# Altium schematic sheet Master.SchDoc: F405 Dev Board
size A4; Author: Alfonso Faria Espinoza; Organization: Waterloop; Address1: 200 University Ave W; Address2: Engineering 5, 1104; Address3: Waterloo, ON; Address4: N2L 3G1; Revision: 1.0; SheetNumber: 1; SheetTotal: 2
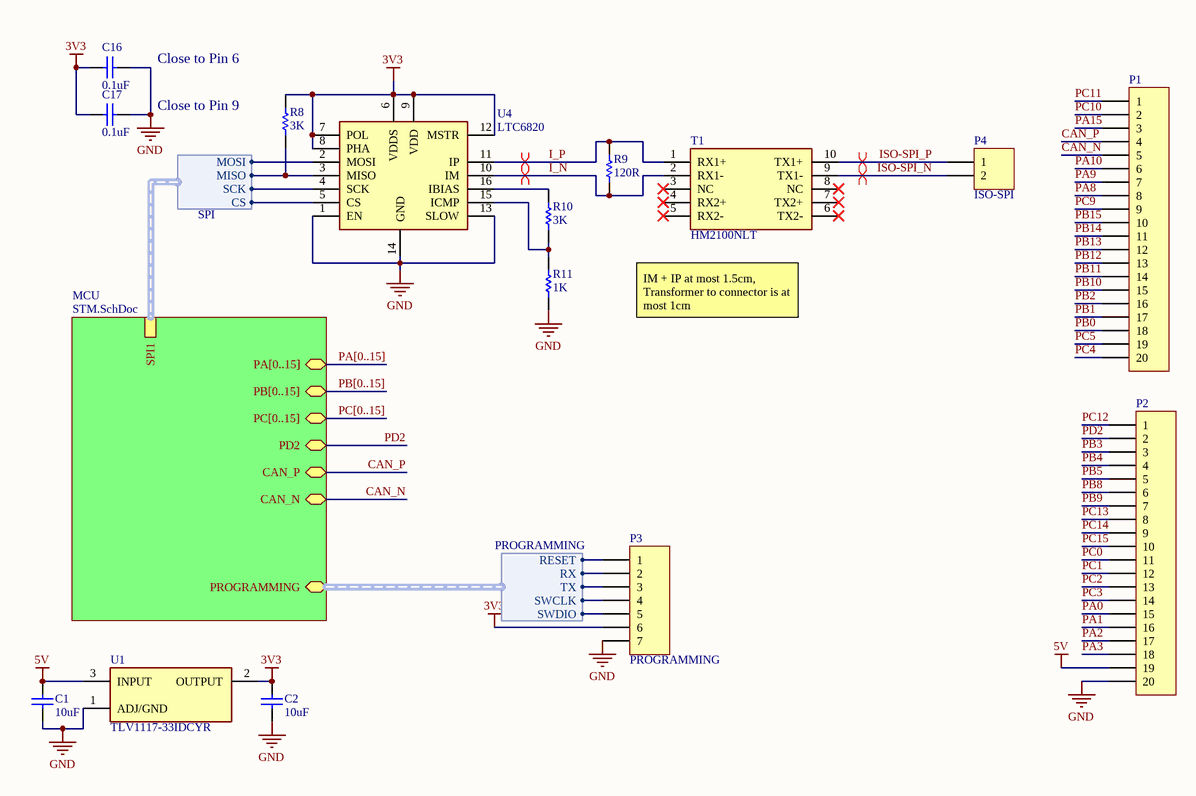
[diagram p0: Master.SchDoc]

## Parts
C1  value 10uF  [0805 - Capacitor]  (hidden comment: Capacitor - Nonpolarized)
C2  value 10uF  [0805 - Capacitor]  (hidden comment: Capacitor - Nonpolarized)
C16  value 0.1uF  [0805 - Capacitor]  (hidden comment: Capacitor - Nonpolarized)
C17  value 0.1uF  [0805 - Capacitor]  (hidden comment: Capacitor - Nonpolarized)
P1  1x20 Header  [HDR1X20]  (value not drawn)
P2  1x20 Header  [HDR1X20]  (value not drawn)
P3  PROGRAMMING  [HDR1X7]
P4  ISO-SPI  [HDR1X2]
R8  value 3K  [0603 - Resistor]  (hidden comment: Resistor)
R9  value 120R  [0603 - Resistor]  (hidden comment: Resistor)
R10  value 3K  [0603 - Resistor]  (hidden comment: Resistor)
R11  value 1K  [0603 - Resistor]  (hidden comment: Resistor)
T1  HM2100NLT  [HM2100NLT]
U1  TLV1117-33IDCYR  [TLV1117]
U4  LTC6820  [LTC6820]

## Sub-sheets
MCU = STM.SchDoc: PA[0..15] (bidir), PB[0..15] (bidir), PC[0..15] (bidir), PD2 (bidir), CAN_P (bidir), CAN_N (bidir), SPI1 (harness SPI), PROGRAMMING (bidir, harness PROGRAMMING)

## Harnesses
SPI: CS, MISO, MOSI, SCK
PROGRAMMING: RESET, RX, SWCLK, SWDIO, TX

## Nets
3V3: C2.2 C16.2 C17.2 P3.6 R8.2 U1.2(OUTPUT) U4.6(VDDS) U4.7(POL) U4.8(PHA) U4.9(VDD) U4.12(MSTR)
5V: C1.2 P2.19 U1.3(INPUT)
GND: C1.1 C2.1 C16.1 C17.1 P2.20 P3.7 R11.1 U1.1(ADJ/GND) U4.1(EN) U4.13(SLOW) U4.14(GND)
CAN_N: P1.5 ; sheet MCU/CAN_N
CAN_P: P1.4 ; sheet MCU/CAN_P
I_N: R9.1 T1.2(RX1-) U4.10(IM)
I_P: R9.2 T1.1(RX1+) U4.11(IP)
ISO-SPI_N: P4.2 T1.9(TX1-)
ISO-SPI_P: P4.1 T1.10(TX1+)
PA0: P2.15
PA1: P2.16
PA2: P2.17
PA3: P2.18
PA8: P1.8
PA9: P1.7
PA10: P1.6
PA15: P1.3
PB0: P1.18
PB1: P1.17
PB2: P1.16
PB3: P2.3
PB4: P2.4
PB5: P2.5
PB8: P2.6
PB9: P2.7
PB10: P1.15
PB11: P1.14
PB12: P1.13
PB13: P1.12
PB14: P1.11
PB15: P1.10
PC0: P2.11
PC1: P2.12
PC2: P2.13
PC3: P2.14
PC4: P1.20
PC5: P1.19
PC9: P1.9
PC10: P1.2
PC11: P1.1
PC12: P2.1
PC13: P2.8
PC14: P2.9
PC15: P2.10
PD2: P2.2 ; sheet MCU/PD2
NetP3_1: P3.1 ; sheet MCU/PROGRAMMING.RESET
NetP3_2: P3.2 ; sheet MCU/PROGRAMMING.RX
NetP3_3: P3.3 ; sheet MCU/PROGRAMMING.TX
NetP3_4: P3.4 ; sheet MCU/PROGRAMMING.SWCLK
NetP3_5: P3.5 ; sheet MCU/PROGRAMMING.SWDIO
NetR8_1: R8.1 U4.3(MISO) ; sheet MCU/SPI1.MISO
NetR10_1: R10.1 R11.2 U4.15(ICMP)
NetR10_2: R10.2 U4.16(IBIAS)
NetU4_2: U4.2(MOSI) ; sheet MCU/SPI1.MOSI
NetU4_4: U4.4(SCK) ; sheet MCU/SPI1.SCK
NetU4_5: U4.5(CS) ; sheet MCU/SPI1.CS

Not connected (* = marked no-connect by the designer): T1 3(NC)* 4(RX2+)* 5(RX2-)* 6(TX2-)* 7(TX2+)* 8(NC)*

## Buses and harness runs
bus PA[0..15] = sheet MCU/PA[0..15]
bus PB[0..15] = sheet MCU/PB[0..15]
bus PC[0..15] = sheet MCU/PC[0..15]

## Layout directives
differential pair; differential pair class ISO: ISO-SPI_N, ISO-SPI_P
differential pair: I_N, I_P

## Notes on the sheet
- Close to Pin 6
- Close to Pin 9
- (near T1) IM + IP at most 1.5cm, Transformer to connector is at most 1cm
- Title:
- Size:
- Date:
- A4
- Author:
- Revision:
- Sheet
- of
- File:

## Library data of the parts
C1 C2 = Capacitor - Nonpolarized: Nonpolarized Capacitor; Manufacturer: Murata; Manufacturer Part Number: GRM21BR71A106KA73K; Rating: 10V; Supplier Part Number: 490-14381-1-ND; Supplier: Digikey
C16 C17 = Capacitor - Nonpolarized: Nonpolarized Capacitor; Manufacturer: Yageo; Manufacturer Part Number: CC0805KRX7R9BB104; Rating: 50V; Supplier Part Number: 311-1140-1-ND; Supplier: Digikey
P1 P2 = 1x20 Header: 1x20 Pin Header
P3 = 1x7 Header: 1x7 Pin Header
P4 = 1x2 Header: 1x2 Pin Header
R8 R10 = Resistor: Manufacturer Part Number: RC0603FR-073KL; Manufacturer: Yageo; Rating: 0.1W; Supplier Part Number: 311-3.00KHRCT-ND; Supplier: Digikey
R9 = Resistor: Manufacturer Part Number: RC0603FR-07120RL; Manufacturer: Yageo; Rating: 0.1W; Supplier Part Number: 311-120HRCT-ND; Supplier: Digikey
R11 = Resistor: Manufacturer Part Number: RC0603FR-071KL; Manufacturer: Yageo; Rating: 0.1W; Supplier Part Number: 311-1.00KHRCT-ND; Supplier: Digikey
T1 = HM2100NLT: Pulse Transformer 1:1 Surface Mount 150µH, 450µH; Manufacturer: Pulse Electronics; Datasheet: https://productfinder.pulseeng.com/doc_type/WEB301/doc_num/HM2100NL/doc_part/HM2100NL.pdf; Supplier Part Number: 1840-1032-1-ND; Supplier: Digikey; Manufacturer Part Number: HM2100NLT
U1 = TLV1117-33IDCYR: Linear Voltage Regulator IC 3.3V 800MA SOT223-4; Manufacturer: Texas Instruments; Datasheet: http://www.ti.com/lit/ds/symlink/tlv1117.pdf?HQS=TI-null-null-digikeymode-df-pf-null-wwe&ts=1590668900314; Manufacturer Part Number: TLV1117-33IDCYR; Supplier Part Number: 296-21112-1-ND; Supplier: Digikey
U4 = LTC6820: Manufacturer: Analog Devices; Manufacturer Part Number: LTC6820IMS#TRPBF; Supplier: Digikey; Supplier Part Number: LTC6820IMS#TRPBFCT-ND